# Altium schematic sheet 3_ADST32-Peripherals.SchDoc
size Letter; SheetNumber: 4; SheetTotal: 4
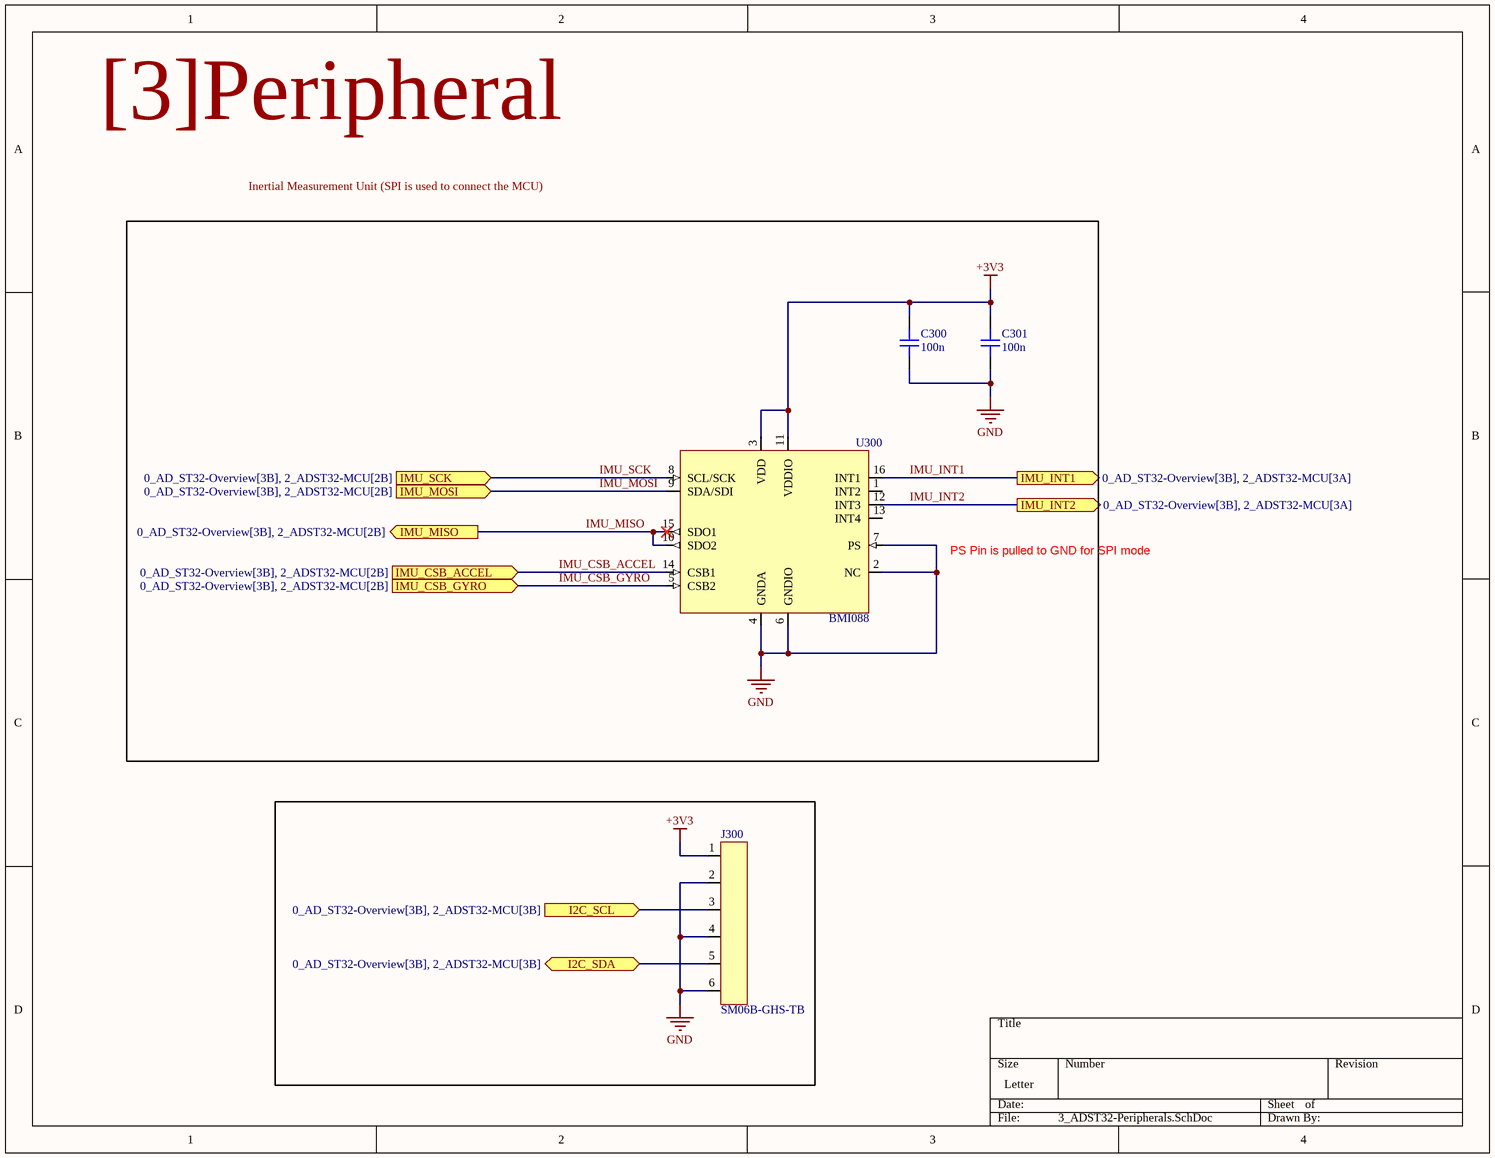
[diagram p0: 3_ADST32-Peripherals.SchDoc]

## Parts
C300  100n  [CAP_0603]
C301  100n  [CAP_0603]
J300  SM06B-GHS-TB  [SM06B-GHS-TB]
U300  BMI088  [BMI088]

## Blocks framed on the sheet
PS Pin is pulled to GND for SPI mode: C300 C301 U300

## Ports
I2C_SCL (in, see 0_AD_ST32-Overview[3B], 2_ADST32-MCU[3B]), I2C_SDA (bidir, see 0_AD_ST32-Overview[3B], 2_ADST32-MCU[3B]), IMU_CSB_ACCEL (in, see 0_AD_ST32-Overview[3B], 2_ADST32-MCU[2B]), IMU_CSB_GYRO (in, see 0_AD_ST32-Overview[3B], 2_ADST32-MCU[2B]), IMU_INT1 (out, see 0_AD_ST32-Overview[3B], 2_ADST32-MCU[3A]), IMU_INT2 (out, see 0_AD_ST32-Overview[3B], 2_ADST32-MCU[3A]), IMU_MISO (out, see 0_AD_ST32-Overview[3B], 2_ADST32-MCU[2B]), IMU_MOSI (in, see 0_AD_ST32-Overview[3B], 2_ADST32-MCU[2B]), IMU_SCK (in, see 0_AD_ST32-Overview[3B], 2_ADST32-MCU[2B])

## Nets
+3V3: C300.2 C301.2 J300.1 U300.3(VDD) U300.11(VDDIO)
GND: C300.1 C301.1 J300.2 J300.4 J300.6 U300.2(NC) U300.4(GNDA) U300.6(GNDIO) U300.7(PS)
I2C_SCL: J300.3 ; port I2C_SCL
I2C_SDA: J300.5 ; port I2C_SDA
IMU_CSB_ACCEL: U300.14(CSB1) ; port IMU_CSB_ACCEL
IMU_CSB_GYRO: U300.5(CSB2) ; port IMU_CSB_GYRO
IMU_INT1: U300.16(INT1) ; port IMU_INT1
IMU_INT2: U300.12(INT3) ; port IMU_INT2
IMU_MISO: U300.10(SDO2) U300.15(SDO1) ; port IMU_MISO
IMU_MOSI: U300.9(SDA/SDI) ; port IMU_MOSI
IMU_SCK: U300.8(SCL/SCK) ; port IMU_SCK

Not connected (* = marked no-connect by the designer): U300 1(INT2) 13(INT4)

## Notes on the sheet
- [3]Peripheral
- Inertial Measurement Unit (SPI is used to connect the MCU)

## Library data of the parts
C300 C301 = CAP_0603: Capacitor SMD 0603; Manufacturer: *; Manufacturer Part Number: *; Distributor Link: *; LCSC: *; Rating: *; Dielectric: *
J300 = SM06B-GHS-TB: Header Connector 6 Position 1.25MM Pitch SMD Horizontal JST GH; Manufacturer: JST; Manufacturer Part Number: SM06B-GHS-TB
U300 = BMI088: Inertial Measurement Unit IMU 6-Axis LGA; Manufacturer: Bosch; Manufacturer Part Number: BMI088